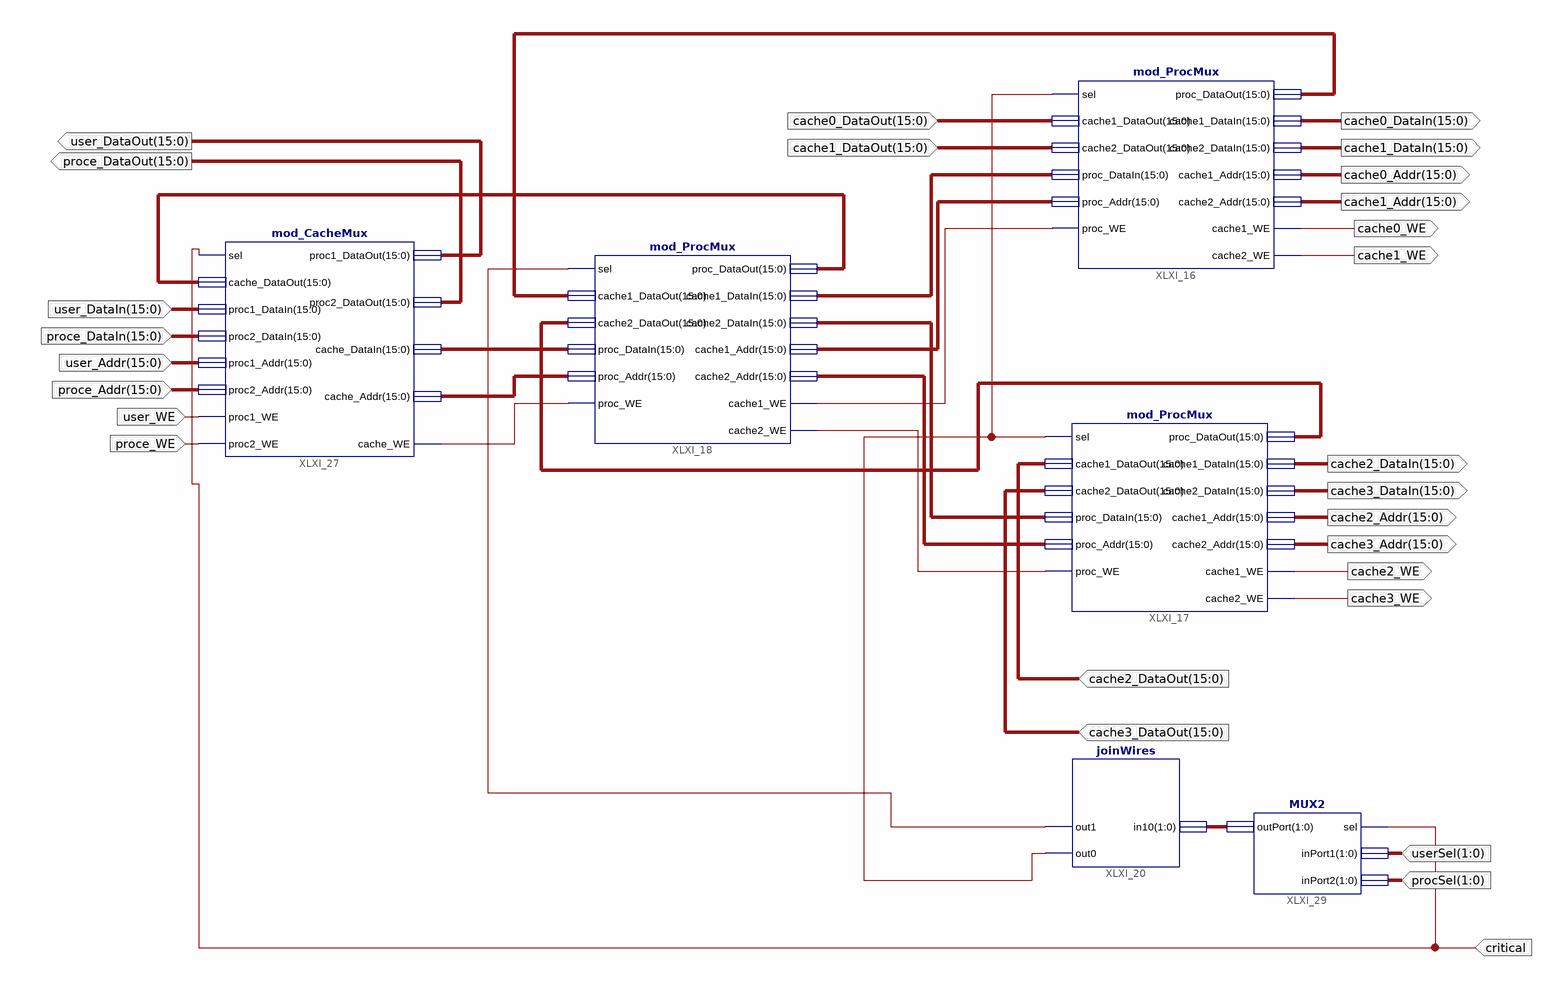
[diagram p0: schematic sheet 1]
// Xilinx ISE schematic mod_ParamRouter.sch (spartan3e) as structural Verilog: 6 symbols, 27 ports
module mod_ParamRouter (
  input  [15:0] cache2_DataOut,
  input  [15:0] cache3_DataOut,
  input  [15:0] cache0_DataOut,
  input  [15:0] cache1_DataOut,
  input  critical,
  input  [15:0] user_DataIn,
  input  [15:0] proce_DataIn,
  input  [15:0] user_Addr,
  input  [15:0] proce_Addr,
  input  user_WE,
  input  proce_WE,
  input  [1:0] userSel,
  input  [1:0] procSel,
  output [15:0] cache2_DataIn,
  output [15:0] cache3_DataIn,
  output [15:0] cache2_Addr,
  output [15:0] cache3_Addr,
  output [15:0] cache0_DataIn,
  output [15:0] cache1_DataIn,
  output [15:0] cache0_Addr,
  output [15:0] cache1_Addr,
  output cache0_WE,
  output cache1_WE,
  output cache2_WE,
  output cache3_WE,
  output [15:0] proce_DataOut,
  output [15:0] user_DataOut
);

  wire proc_WE, XLXN_8, XLXN_9, XLXN_21, XLXN_34;
  wire [1:0] sel;
  wire [15:0] proc_Addr, proc_DataIn, proc_DataOut, XLXN_3, XLXN_4, XLXN_5, XLXN_6, XLXN_11, XLXN_12;

  mod_ProcMux XLXI_16 (
    .sel(XLXN_34), .cache1_DataOut(cache0_DataOut), .cache2_DataOut(cache1_DataOut), .proc_DataIn(XLXN_3),
    .proc_Addr(XLXN_5), .proc_WE(XLXN_8), .proc_DataOut(XLXN_11), .cache1_DataIn(cache0_DataIn),
    .cache2_DataIn(cache1_DataIn), .cache1_Addr(cache0_Addr), .cache2_Addr(cache1_Addr),
    .cache1_WE(cache0_WE), .cache2_WE(cache1_WE));
  mod_ProcMux XLXI_17 (
    .sel(XLXN_34), .cache1_DataOut(cache2_DataOut), .cache2_DataOut(cache3_DataOut), .proc_DataIn(XLXN_4),
    .proc_Addr(XLXN_6), .proc_WE(XLXN_9), .proc_DataOut(XLXN_12), .cache1_DataIn(cache2_DataIn),
    .cache2_DataIn(cache3_DataIn), .cache1_Addr(cache2_Addr), .cache2_Addr(cache3_Addr),
    .cache1_WE(cache2_WE), .cache2_WE(cache3_WE));
  mod_ProcMux XLXI_18 (
    .sel(XLXN_21), .cache1_DataOut(XLXN_11), .cache2_DataOut(XLXN_12), .proc_DataIn(proc_DataIn),
    .proc_Addr(proc_Addr), .proc_WE(proc_WE), .proc_DataOut(proc_DataOut), .cache1_DataIn(XLXN_3),
    .cache2_DataIn(XLXN_4), .cache1_Addr(XLXN_5), .cache2_Addr(XLXN_6), .cache1_WE(XLXN_8), .cache2_WE(XLXN_9));
  joinWires XLXI_20 (.in10(sel), .out1(XLXN_21), .out0(XLXN_34));
  mod_CacheMux XLXI_27 (
    .sel(critical), .cache_DataOut(proc_DataOut), .proc1_DataIn(user_DataIn), .proc2_DataIn(proce_DataIn),
    .proc1_Addr(user_Addr), .proc2_Addr(proce_Addr), .proc1_WE(user_WE), .proc2_WE(proce_WE),
    .proc1_DataOut(user_DataOut), .proc2_DataOut(proce_DataOut), .cache_DataIn(proc_DataIn),
    .cache_Addr(proc_Addr), .cache_WE(proc_WE));
  MUX2 XLXI_29 (.sel(critical), .inPort1(userSel), .inPort2(procSel), .outPort(sel));
endmodule
